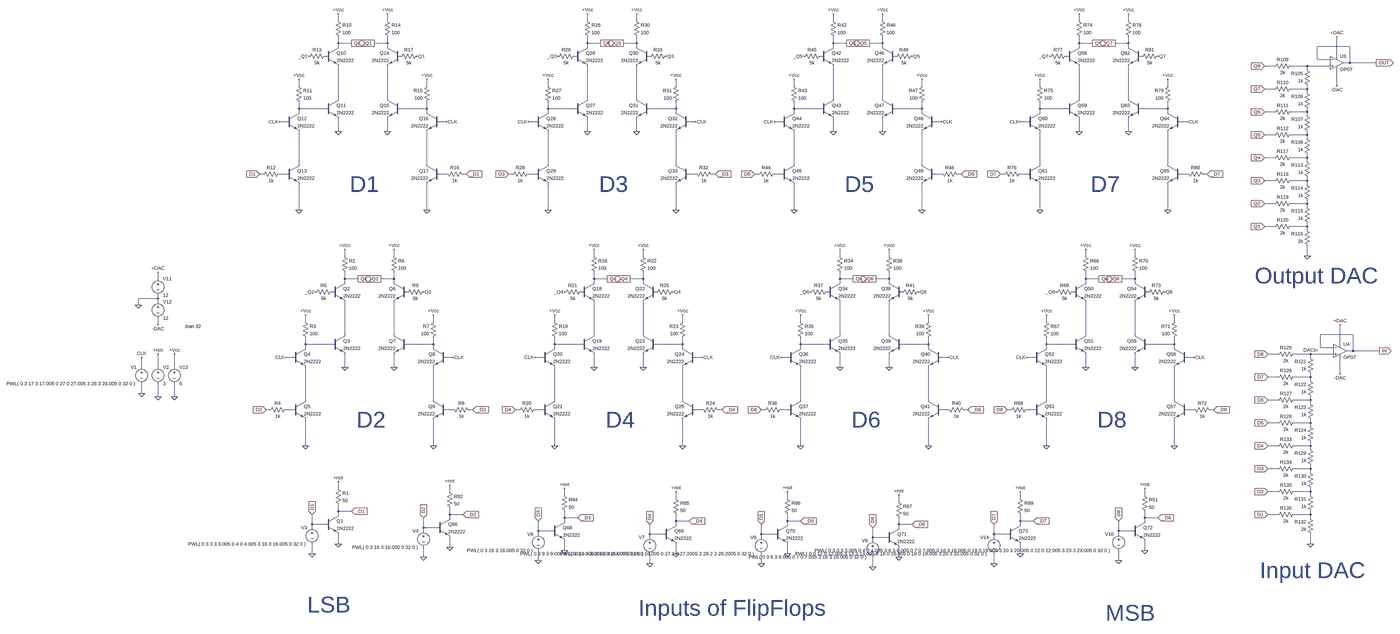
[diagram p0: schematic 1 Byte Memory.asc, whole sheet]
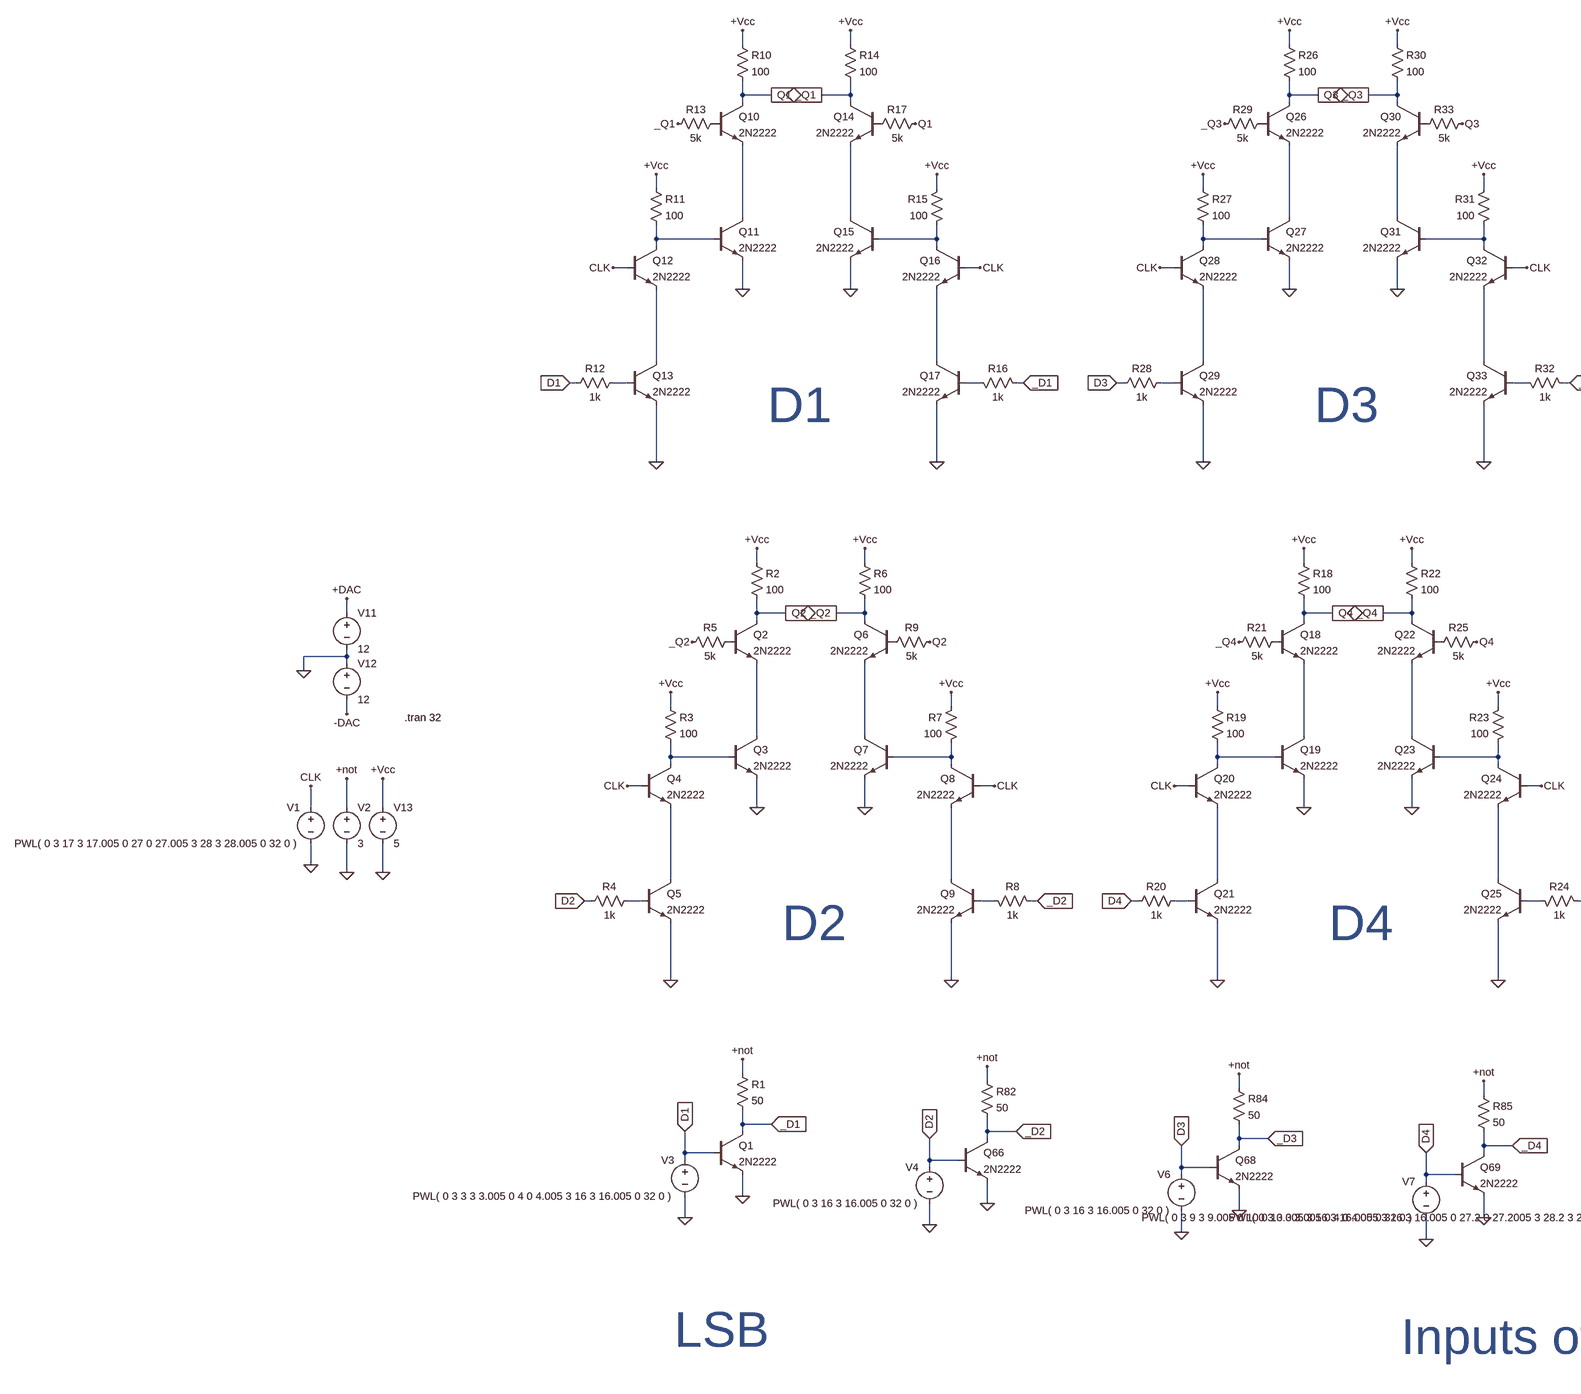
[diagram p1: schematic 1 Byte Memory.asc, part, row 1 of 1, column 1 of 2]
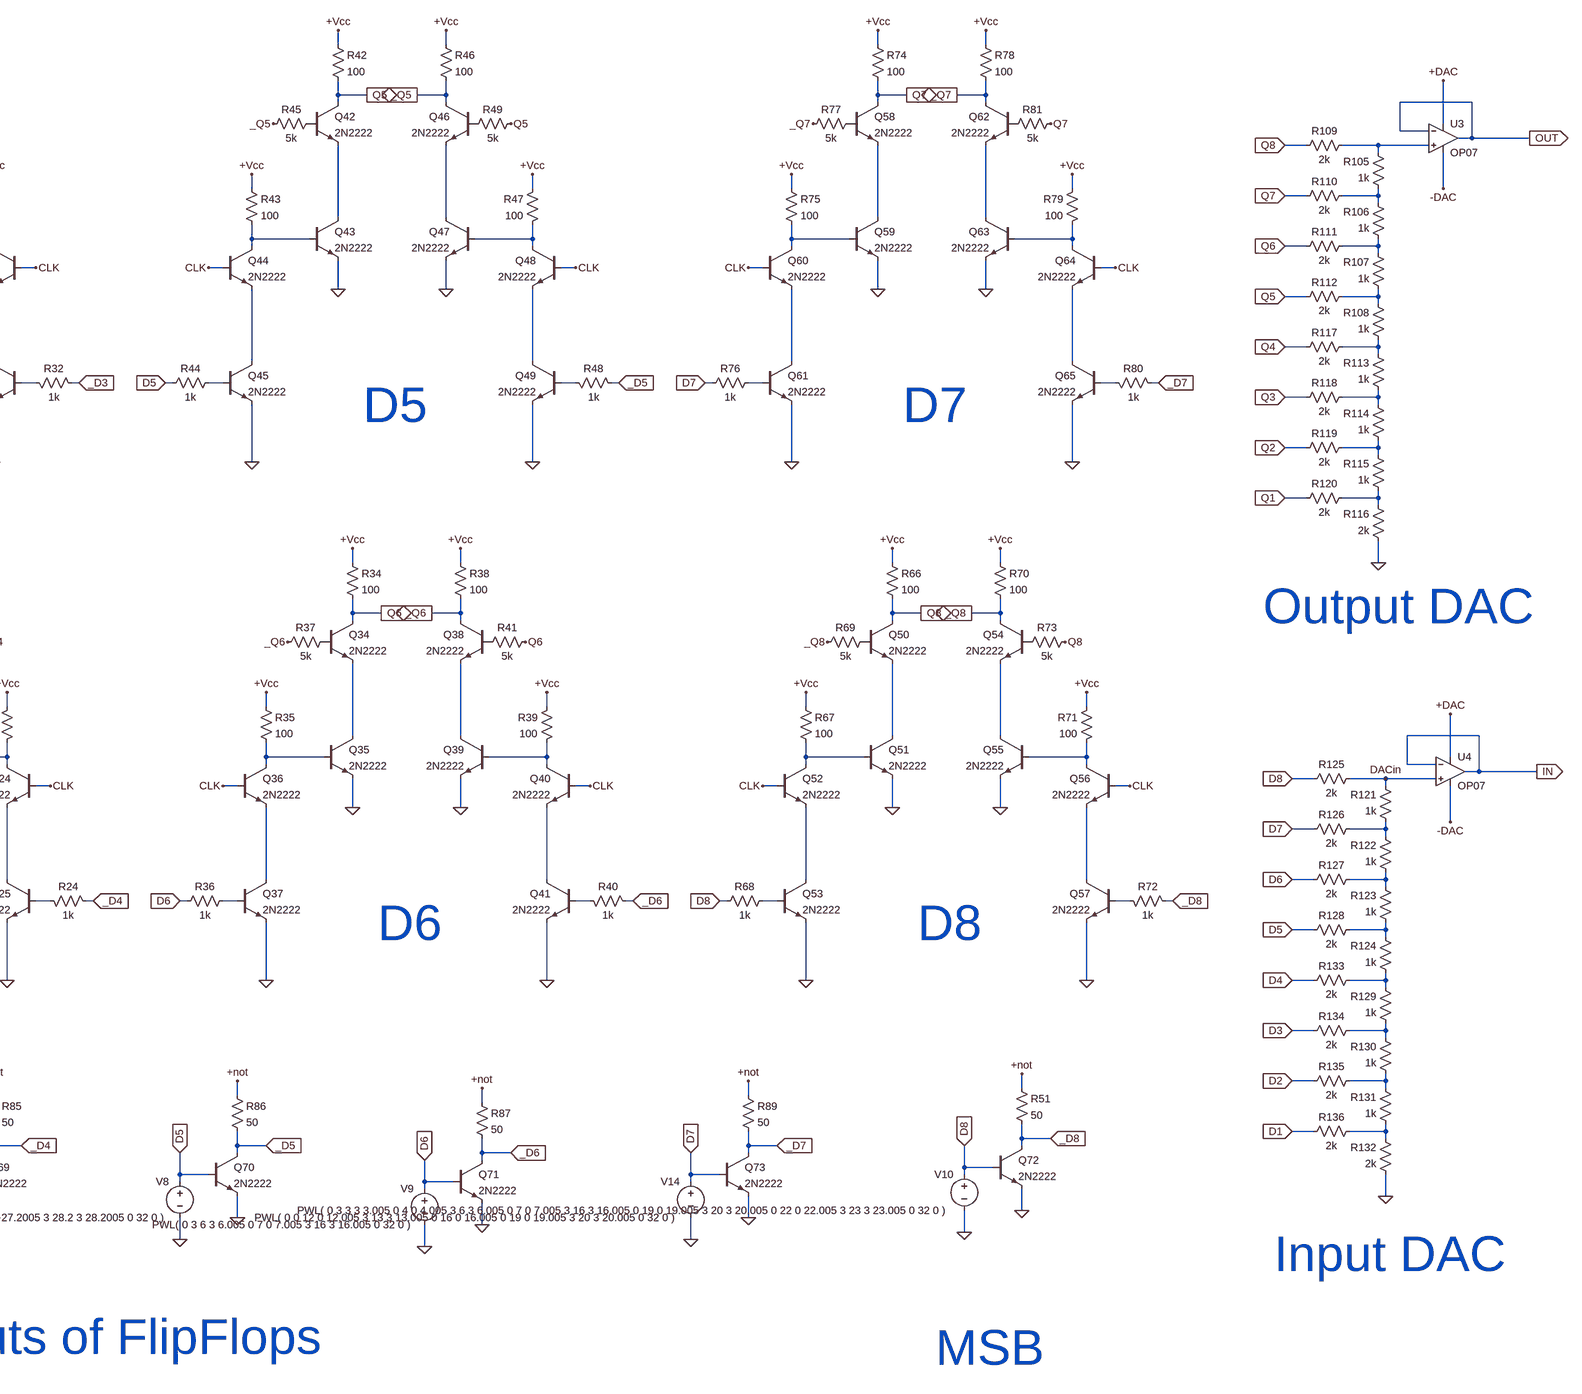
[diagram p2: schematic 1 Byte Memory.asc, part, row 1 of 1, column 2 of 2]
1 Byte Memory.asc, the LTspice schematic file:
Version 4
SHEET 1 6188 6752
WIRE 496 112 496 80
WIRE 736 112 736 80
WIRE 1712 112 1712 80
WIRE 1952 112 1952 80
WIRE 2912 112 2912 80
WIRE 3152 112 3152 80
WIRE 4112 112 4112 80
WIRE 4352 112 4352 80
WIRE 496 224 496 192
WIRE 560 224 496 224
WIRE 736 224 736 192
WIRE 736 224 672 224
WIRE 1712 224 1712 192
WIRE 1776 224 1712 224
WIRE 1952 224 1952 192
WIRE 1952 224 1888 224
WIRE 2912 224 2912 192
WIRE 2976 224 2912 224
WIRE 3152 224 3152 192
WIRE 3152 224 3088 224
WIRE 4112 224 4112 192
WIRE 4176 224 4112 224
WIRE 4352 224 4352 192
WIRE 4352 224 4288 224
WIRE 496 240 496 224
WIRE 736 240 736 224
WIRE 1712 240 1712 224
WIRE 1952 240 1952 224
WIRE 2912 240 2912 224
WIRE 3152 240 3152 224
WIRE 4112 240 4112 224
WIRE 4352 240 4352 224
WIRE 5536 240 5376 240
WIRE 5472 288 5472 192
WIRE 5376 304 5376 240
WIRE 5440 304 5376 304
WIRE 5536 320 5536 240
WIRE 5536 320 5504 320
WIRE 5664 320 5536 320
WIRE 5168 336 5120 336
WIRE 5328 336 5248 336
WIRE 5440 336 5328 336
WIRE 5328 352 5328 336
WIRE 304 432 304 400
WIRE 928 432 928 400
WIRE 1520 432 1520 400
WIRE 2144 432 2144 400
WIRE 2720 432 2720 400
WIRE 3344 432 3344 400
WIRE 3920 432 3920 400
WIRE 4544 432 4544 400
WIRE 5472 432 5472 352
WIRE 5168 448 5120 448
WIRE 5328 448 5328 432
WIRE 5328 448 5248 448
WIRE 5328 464 5328 448
WIRE 496 496 496 336
WIRE 736 496 736 336
WIRE 1712 496 1712 336
WIRE 1952 496 1952 336
WIRE 2912 496 2912 336
WIRE 3152 496 3152 336
WIRE 4112 496 4112 336
WIRE 4352 496 4352 336
WIRE 304 544 304 512
WIRE 432 544 304 544
WIRE 928 544 928 512
WIRE 928 544 800 544
WIRE 1520 544 1520 512
WIRE 1648 544 1520 544
WIRE 2144 544 2144 512
WIRE 2144 544 2016 544
WIRE 2720 544 2720 512
WIRE 2848 544 2720 544
WIRE 3344 544 3344 512
WIRE 3344 544 3216 544
WIRE 3920 544 3920 512
WIRE 4048 544 3920 544
WIRE 4544 544 4544 512
WIRE 4544 544 4416 544
WIRE 304 560 304 544
WIRE 928 560 928 544
WIRE 1520 560 1520 544
WIRE 2144 560 2144 544
WIRE 2720 560 2720 544
WIRE 3344 560 3344 544
WIRE 3920 560 3920 544
WIRE 4544 560 4544 544
WIRE 5168 560 5120 560
WIRE 5328 560 5328 544
WIRE 5328 560 5248 560
WIRE 5328 576 5328 560
WIRE 240 608 208 608
WIRE 1024 608 992 608
WIRE 1456 608 1424 608
WIRE 2240 608 2208 608
WIRE 2656 608 2624 608
WIRE 3440 608 3408 608
WIRE 3856 608 3824 608
WIRE 4640 608 4608 608
WIRE 496 656 496 592
WIRE 736 656 736 592
WIRE 1712 656 1712 592
WIRE 1952 656 1952 592
WIRE 2912 656 2912 592
WIRE 3152 656 3152 592
WIRE 4112 656 4112 592
WIRE 4352 656 4352 592
WIRE 5168 672 5120 672
WIRE 5328 672 5328 656
WIRE 5328 672 5248 672
WIRE 5328 688 5328 672
WIRE 5168 784 5120 784
WIRE 5328 784 5328 768
WIRE 5328 784 5248 784
WIRE 5328 800 5328 784
WIRE 304 816 304 656
WIRE 928 816 928 656
WIRE 1520 816 1520 656
WIRE 2144 816 2144 656
WIRE 2720 816 2720 656
WIRE 3344 816 3344 656
WIRE 3920 816 3920 656
WIRE 4544 816 4544 656
WIRE 128 864 112 864
WIRE 240 864 208 864
WIRE 1024 864 992 864
WIRE 1120 864 1104 864
WIRE 1344 864 1328 864
WIRE 1456 864 1424 864
WIRE 2240 864 2208 864
WIRE 2336 864 2320 864
WIRE 2544 864 2528 864
WIRE 2656 864 2624 864
WIRE 3440 864 3408 864
WIRE 3536 864 3520 864
WIRE 3744 864 3728 864
WIRE 3856 864 3824 864
WIRE 4640 864 4608 864
WIRE 4736 864 4720 864
WIRE 5168 896 5120 896
WIRE 5328 896 5328 880
WIRE 5328 896 5248 896
WIRE 5328 912 5328 896
WIRE 5168 1008 5120 1008
WIRE 5328 1008 5328 992
WIRE 5328 1008 5248 1008
WIRE 5328 1024 5328 1008
WIRE 304 1040 304 912
WIRE 928 1040 928 912
WIRE 1520 1040 1520 912
WIRE 2144 1040 2144 912
WIRE 2720 1040 2720 912
WIRE 3344 1040 3344 912
WIRE 3920 1040 3920 912
WIRE 4544 1040 4544 912
WIRE 5168 1120 5120 1120
WIRE 5328 1120 5328 1104
WIRE 5328 1120 5248 1120
WIRE 5328 1136 5328 1120
WIRE 528 1264 528 1232
WIRE 768 1264 768 1232
WIRE 1744 1264 1744 1232
WIRE 1984 1264 1984 1232
WIRE 2944 1264 2944 1232
WIRE 3184 1264 3184 1232
WIRE 4144 1264 4144 1232
WIRE 4384 1264 4384 1232
WIRE 5328 1264 5328 1216
WIRE -384 1376 -384 1344
WIRE 528 1376 528 1344
WIRE 592 1376 528 1376
WIRE 768 1376 768 1344
WIRE 768 1376 704 1376
WIRE 1744 1376 1744 1344
WIRE 1808 1376 1744 1376
WIRE 1984 1376 1984 1344
WIRE 1984 1376 1920 1376
WIRE 2944 1376 2944 1344
WIRE 3008 1376 2944 1376
WIRE 3184 1376 3184 1344
WIRE 3184 1376 3120 1376
WIRE 4144 1376 4144 1344
WIRE 4208 1376 4144 1376
WIRE 4384 1376 4384 1344
WIRE 4384 1376 4320 1376
WIRE 528 1392 528 1376
WIRE 768 1392 768 1376
WIRE 1744 1392 1744 1376
WIRE 1984 1392 1984 1376
WIRE 2944 1392 2944 1376
WIRE 3184 1392 3184 1376
WIRE 4144 1392 4144 1376
WIRE 4384 1392 4384 1376
WIRE -384 1472 -384 1456
WIRE -384 1472 -480 1472
WIRE -384 1488 -384 1472
WIRE -480 1504 -480 1472
WIRE 336 1584 336 1552
WIRE 960 1584 960 1552
WIRE 1552 1584 1552 1552
WIRE 2176 1584 2176 1552
WIRE 2752 1584 2752 1552
WIRE 3376 1584 3376 1552
WIRE 3952 1584 3952 1552
WIRE 4576 1584 4576 1552
WIRE -384 1600 -384 1568
WIRE 528 1648 528 1488
WIRE 768 1648 768 1488
WIRE 1744 1648 1744 1488
WIRE 1984 1648 1984 1488
WIRE 2944 1648 2944 1488
WIRE 3184 1648 3184 1488
WIRE 4144 1648 4144 1488
WIRE 4384 1648 4384 1488
WIRE 5552 1648 5392 1648
WIRE 336 1696 336 1664
WIRE 464 1696 336 1696
WIRE 960 1696 960 1664
WIRE 960 1696 832 1696
WIRE 1552 1696 1552 1664
WIRE 1680 1696 1552 1696
WIRE 2176 1696 2176 1664
WIRE 2176 1696 2048 1696
WIRE 2752 1696 2752 1664
WIRE 2880 1696 2752 1696
WIRE 3376 1696 3376 1664
WIRE 3376 1696 3248 1696
WIRE 3952 1696 3952 1664
WIRE 4080 1696 3952 1696
WIRE 4576 1696 4576 1664
WIRE 4576 1696 4448 1696
WIRE 5488 1696 5488 1600
WIRE 336 1712 336 1696
WIRE 960 1712 960 1696
WIRE 1552 1712 1552 1696
WIRE 2176 1712 2176 1696
WIRE 2752 1712 2752 1696
WIRE 3376 1712 3376 1696
WIRE 3952 1712 3952 1696
WIRE 4576 1712 4576 1696
WIRE 5392 1712 5392 1648
WIRE 5456 1712 5392 1712
WIRE 5552 1728 5552 1648
WIRE 5552 1728 5520 1728
WIRE 5680 1728 5552 1728
WIRE 5184 1744 5136 1744
WIRE 5344 1744 5264 1744
WIRE 5456 1744 5344 1744
WIRE 272 1760 240 1760
WIRE 1056 1760 1024 1760
WIRE 1488 1760 1456 1760
WIRE 2272 1760 2240 1760
WIRE 2688 1760 2656 1760
WIRE 3472 1760 3440 1760
WIRE 3888 1760 3856 1760
WIRE 4672 1760 4640 1760
WIRE 5344 1760 5344 1744
WIRE -464 1808 -464 1760
WIRE -384 1808 -384 1744
WIRE -304 1808 -304 1744
WIRE 528 1808 528 1744
WIRE 768 1808 768 1744
WIRE 1744 1808 1744 1744
WIRE 1984 1808 1984 1744
WIRE 2944 1808 2944 1744
WIRE 3184 1808 3184 1744
WIRE 4144 1808 4144 1744
WIRE 4384 1808 4384 1744
WIRE 5488 1840 5488 1760
WIRE 5184 1856 5136 1856
WIRE 5344 1856 5344 1840
WIRE 5344 1856 5264 1856
WIRE 5344 1872 5344 1856
WIRE -464 1936 -464 1888
WIRE -384 1952 -384 1888
WIRE -304 1952 -304 1888
WIRE 336 1968 336 1808
WIRE 960 1968 960 1808
WIRE 1552 1968 1552 1808
WIRE 2176 1968 2176 1808
WIRE 2752 1968 2752 1808
WIRE 3376 1968 3376 1808
WIRE 3952 1968 3952 1808
WIRE 4576 1968 4576 1808
WIRE 5184 1968 5136 1968
WIRE 5344 1968 5344 1952
WIRE 5344 1968 5264 1968
WIRE 5344 1984 5344 1968
WIRE 160 2016 144 2016
WIRE 272 2016 240 2016
WIRE 1056 2016 1024 2016
WIRE 1152 2016 1136 2016
WIRE 1376 2016 1360 2016
WIRE 1488 2016 1456 2016
WIRE 2272 2016 2240 2016
WIRE 2368 2016 2352 2016
WIRE 2576 2016 2560 2016
WIRE 2688 2016 2656 2016
WIRE 3472 2016 3440 2016
WIRE 3568 2016 3552 2016
WIRE 3776 2016 3760 2016
WIRE 3888 2016 3856 2016
WIRE 4672 2016 4640 2016
WIRE 4768 2016 4752 2016
WIRE 5184 2080 5136 2080
WIRE 5344 2080 5344 2064
WIRE 5344 2080 5264 2080
WIRE 5344 2096 5344 2080
WIRE 336 2192 336 2064
WIRE 960 2192 960 2064
WIRE 1552 2192 1552 2064
WIRE 2176 2192 2176 2064
WIRE 2752 2192 2752 2064
WIRE 3376 2192 3376 2064
WIRE 3952 2192 3952 2064
WIRE 4576 2192 4576 2064
WIRE 5184 2192 5136 2192
WIRE 5344 2192 5344 2176
WIRE 5344 2192 5264 2192
WIRE 5344 2208 5344 2192
WIRE 5184 2304 5136 2304
WIRE 5344 2304 5344 2288
WIRE 5344 2304 5264 2304
WIRE 5344 2320 5344 2304
WIRE 496 2400 496 2368
WIRE 1040 2416 1040 2384
WIRE 5184 2416 5136 2416
WIRE 5344 2416 5344 2400
WIRE 5344 2416 5264 2416
WIRE 1600 2432 1600 2400
WIRE 4432 2432 4432 2400
WIRE 5344 2432 5344 2416
WIRE 2144 2448 2144 2416
WIRE 2688 2448 2688 2416
WIRE 3824 2448 3824 2416
WIRE 3232 2464 3232 2432
WIRE 496 2512 496 2480
WIRE 560 2512 496 2512
WIRE 496 2528 496 2512
WIRE 1040 2528 1040 2496
WIRE 1104 2528 1040 2528
WIRE 5184 2528 5136 2528
WIRE 5344 2528 5344 2512
WIRE 5344 2528 5264 2528
WIRE 1040 2544 1040 2528
WIRE 1600 2544 1600 2512
WIRE 1664 2544 1600 2544
WIRE 4432 2544 4432 2512
WIRE 4496 2544 4432 2544
WIRE 5344 2544 5344 2528
WIRE 1600 2560 1600 2544
WIRE 2144 2560 2144 2528
WIRE 2208 2560 2144 2560
WIRE 2688 2560 2688 2528
WIRE 2752 2560 2688 2560
WIRE 3824 2560 3824 2528
WIRE 3888 2560 3824 2560
WIRE 4432 2560 4432 2544
WIRE 368 2576 368 2528
WIRE 432 2576 368 2576
WIRE 2144 2576 2144 2560
WIRE 2688 2576 2688 2560
WIRE 3232 2576 3232 2544
WIRE 3296 2576 3232 2576
WIRE 3824 2576 3824 2560
WIRE 368 2592 368 2576
WIRE 912 2592 912 2544
WIRE 976 2592 912 2592
WIRE 3232 2592 3232 2576
WIRE 912 2608 912 2592
WIRE 1472 2608 1472 2560
WIRE 1536 2608 1472 2608
WIRE 4304 2608 4304 2560
WIRE 4368 2608 4304 2608
WIRE 1472 2624 1472 2608
WIRE 2016 2624 2016 2576
WIRE 2080 2624 2016 2624
WIRE 2560 2624 2560 2576
WIRE 2624 2624 2560 2624
WIRE 3696 2624 3696 2576
WIRE 3760 2624 3696 2624
WIRE 4304 2624 4304 2608
WIRE 2016 2640 2016 2624
WIRE 2560 2640 2560 2624
WIRE 3104 2640 3104 2592
WIRE 3168 2640 3104 2640
WIRE 3696 2640 3696 2624
WIRE 3104 2656 3104 2640
WIRE 496 2672 496 2624
WIRE 5344 2672 5344 2624
WIRE 1040 2688 1040 2640
WIRE 1600 2704 1600 2656
WIRE 4432 2704 4432 2656
WIRE 368 2720 368 2672
WIRE 2144 2720 2144 2672
WIRE 2688 2720 2688 2672
WIRE 3824 2720 3824 2672
WIRE 912 2736 912 2688
WIRE 3232 2736 3232 2688
WIRE 1472 2752 1472 2704
WIRE 4304 2752 4304 2704
WIRE 2016 2768 2016 2720
WIRE 2560 2768 2560 2720
WIRE 3696 2768 3696 2720
WIRE 3104 2784 3104 2736
FLAG -384 1344 +DAC
FLAG -480 1504 0
FLAG -384 1600 -DAC
FLAG -464 1936 0
FLAG -464 1760 CLK
FLAG -384 1744 +not
FLAG -384 1952 0
FLAG -304 1952 0
FLAG -304 1744 +Vcc
FLAG 528 1232 +Vcc
FLAG 336 1552 +Vcc
FLAG 336 2192 0
FLAG 528 1808 0
FLAG 384 1440 _Q2
FLAG 592 1376 Q2
IOPIN 592 1376 Out
FLAG 240 1760 CLK
FLAG 144 2016 D2
IOPIN 144 2016 In
FLAG 768 1232 +Vcc
FLAG 960 1552 +Vcc
FLAG 960 2192 0
FLAG 768 1808 0
FLAG 912 1440 Q2
FLAG 704 1376 _Q2
IOPIN 704 1376 Out
FLAG 1056 1760 CLK
FLAG 1152 2016 _D2
IOPIN 1152 2016 In
FLAG 496 80 +Vcc
FLAG 304 400 +Vcc
FLAG 304 1040 0
FLAG 496 656 0
FLAG 352 288 _Q1
FLAG 560 224 Q1
IOPIN 560 224 Out
FLAG 208 608 CLK
FLAG 112 864 D1
IOPIN 112 864 In
FLAG 736 80 +Vcc
FLAG 928 400 +Vcc
FLAG 928 1040 0
FLAG 736 656 0
FLAG 880 288 Q1
FLAG 672 224 _Q1
IOPIN 672 224 Out
FLAG 1024 608 CLK
FLAG 1120 864 _D1
IOPIN 1120 864 In
FLAG 1744 1232 +Vcc
FLAG 1552 1552 +Vcc
FLAG 1552 2192 0
FLAG 1744 1808 0
FLAG 1600 1440 _Q4
FLAG 1808 1376 Q4
IOPIN 1808 1376 Out
FLAG 1456 1760 CLK
FLAG 1360 2016 D4
IOPIN 1360 2016 In
FLAG 1984 1232 +Vcc
FLAG 2176 1552 +Vcc
FLAG 2176 2192 0
FLAG 1984 1808 0
FLAG 2128 1440 Q4
FLAG 1920 1376 _Q4
IOPIN 1920 1376 Out
FLAG 2272 1760 CLK
FLAG 2368 2016 _D4
IOPIN 2368 2016 In
FLAG 1712 80 +Vcc
FLAG 1520 400 +Vcc
FLAG 1520 1040 0
FLAG 1712 656 0
FLAG 1568 288 _Q3
FLAG 1776 224 Q3
IOPIN 1776 224 Out
FLAG 1424 608 CLK
FLAG 1328 864 D3
IOPIN 1328 864 In
FLAG 1952 80 +Vcc
FLAG 2144 400 +Vcc
FLAG 2144 1040 0
FLAG 1952 656 0
FLAG 2096 288 Q3
FLAG 1888 224 _Q3
IOPIN 1888 224 Out
FLAG 2240 608 CLK
FLAG 2336 864 _D3
IOPIN 2336 864 In
FLAG 2944 1232 +Vcc
FLAG 2752 1552 +Vcc
FLAG 2752 2192 0
FLAG 2944 1808 0
FLAG 2800 1440 _Q6
FLAG 3008 1376 Q6
IOPIN 3008 1376 Out
FLAG 2656 1760 CLK
FLAG 2560 2016 D6
IOPIN 2560 2016 In
FLAG 3184 1232 +Vcc
FLAG 3376 1552 +Vcc
FLAG 3376 2192 0
FLAG 3184 1808 0
FLAG 3328 1440 Q6
FLAG 3120 1376 _Q6
IOPIN 3120 1376 Out
FLAG 3472 1760 CLK
FLAG 3568 2016 _D6
IOPIN 3568 2016 In
FLAG 2912 80 +Vcc
FLAG 2720 400 +Vcc
FLAG 2720 1040 0
FLAG 2912 656 0
FLAG 2768 288 _Q5
FLAG 2976 224 Q5
IOPIN 2976 224 Out
FLAG 2624 608 CLK
FLAG 2528 864 D5
IOPIN 2528 864 In
FLAG 3152 80 +Vcc
FLAG 3344 400 +Vcc
FLAG 3344 1040 0
FLAG 3152 656 0
FLAG 3296 288 Q5
FLAG 3088 224 _Q5
IOPIN 3088 224 Out
FLAG 3440 608 CLK
FLAG 3536 864 _D5
IOPIN 3536 864 In
FLAG 4144 1232 +Vcc
FLAG 3952 1552 +Vcc
FLAG 3952 2192 0
FLAG 4144 1808 0
FLAG 4000 1440 _Q8
FLAG 4208 1376 Q8
IOPIN 4208 1376 Out
FLAG 3856 1760 CLK
FLAG 3760 2016 D8
IOPIN 3760 2016 In
FLAG 4384 1232 +Vcc
FLAG 4576 1552 +Vcc
FLAG 4576 2192 0
FLAG 4384 1808 0
FLAG 4528 1440 Q8
FLAG 4320 1376 _Q8
IOPIN 4320 1376 Out
FLAG 4672 1760 CLK
FLAG 4768 2016 _D8
IOPIN 4768 2016 In
FLAG 4112 80 +Vcc
FLAG 3920 400 +Vcc
FLAG 3920 1040 0
FLAG 4112 656 0
FLAG 3968 288 _Q7
FLAG 4176 224 Q7
IOPIN 4176 224 Out
FLAG 3824 608 CLK
FLAG 3728 864 D7
IOPIN 3728 864 In
FLAG 4352 80 +Vcc
FLAG 4544 400 +Vcc
FLAG 4544 1040 0
FLAG 4352 656 0
FLAG 4496 288 Q7
FLAG 4288 224 _Q7
IOPIN 4288 224 Out
FLAG 4640 608 CLK
FLAG 4736 864 _D7
IOPIN 4736 864 In
FLAG 496 2368 +not
FLAG 496 2672 0
FLAG 560 2512 _D1
IOPIN 560 2512 In
FLAG 368 2720 0
FLAG 368 2528 D1
IOPIN 368 2528 In
FLAG 1040 2384 +not
FLAG 1040 2688 0
FLAG 1104 2528 _D2
IOPIN 1104 2528 In
FLAG 912 2736 0
FLAG 912 2544 D2
IOPIN 912 2544 In
FLAG 1600 2400 +not
FLAG 1600 2704 0
FLAG 1664 2544 _D3
IOPIN 1664 2544 In
FLAG 1472 2752 0
FLAG 1472 2560 D3
IOPIN 1472 2560 In
FLAG 2144 2416 +not
FLAG 2144 2720 0
FLAG 2208 2560 _D4
IOPIN 2208 2560 In
FLAG 2016 2768 0
FLAG 2016 2576 D4
IOPIN 2016 2576 In
FLAG 2688 2416 +not
FLAG 2688 2720 0
FLAG 2752 2560 _D5
IOPIN 2752 2560 In
FLAG 2560 2768 0
FLAG 2560 2576 D5
IOPIN 2560 2576 In
FLAG 3232 2432 +not
FLAG 3232 2736 0
FLAG 3296 2576 _D6
IOPIN 3296 2576 In
FLAG 3104 2784 0
FLAG 3104 2592 D6
IOPIN 3104 2592 In
FLAG 3824 2416 +not
FLAG 3824 2720 0
FLAG 3888 2560 _D7
IOPIN 3888 2560 In
FLAG 3696 2768 0
FLAG 3696 2576 D7
IOPIN 3696 2576 In
FLAG 5664 320 OUT
IOPIN 5664 320 Out
FLAG 5120 336 Q8
IOPIN 5120 336 In
FLAG 5120 448 Q7
IOPIN 5120 448 In
FLAG 5120 560 Q6
IOPIN 5120 560 In
FLAG 5120 672 Q5
IOPIN 5120 672 In
FLAG 5472 192 +DAC
FLAG 5472 432 -DAC
FLAG 5120 784 Q4
IOPIN 5120 784 In
FLAG 5120 896 Q3
IOPIN 5120 896 In
FLAG 5120 1008 Q2
IOPIN 5120 1008 In
FLAG 5120 1120 Q1
IOPIN 5120 1120 In
FLAG 5328 1264 0
FLAG 5680 1728 IN
IOPIN 5680 1728 Out
FLAG 5136 1744 D8
IOPIN 5136 1744 In
FLAG 5136 1856 D7
IOPIN 5136 1856 In
FLAG 5136 1968 D6
IOPIN 5136 1968 In
FLAG 5136 2080 D5
IOPIN 5136 2080 In
FLAG 5488 1600 +DAC
FLAG 5488 1840 -DAC
FLAG 5136 2192 D4
IOPIN 5136 2192 In
FLAG 5136 2304 D3
IOPIN 5136 2304 In
FLAG 5136 2416 D2
IOPIN 5136 2416 In
FLAG 5136 2528 D1
IOPIN 5136 2528 In
FLAG 5344 2672 0
FLAG 5344 1744 DACin
FLAG 4432 2400 +not
FLAG 4432 2704 0
FLAG 4496 2544 _D8
IOPIN 4496 2544 In
FLAG 4304 2752 0
FLAG 4304 2560 D8
IOPIN 4304 2560 In
SYMBOL voltage -384 1360 R0
SYMATTR InstName V11
SYMATTR Value 12
SYMBOL voltage -384 1472 R0
SYMATTR InstName V12
SYMATTR Value 12
SYMBOL voltage -464 1792 M0
SYMATTR InstName V1
SYMATTR Value PWL( 0 3 17 3 17.005 0 27 0 27.005 3 28 3 28.005 0 32 0 )
SYMBOL voltage -384 1792 R0
SYMATTR InstName V2
SYMATTR Value 3
SYMBOL voltage -304 1792 R0
SYMATTR InstName V13
SYMATTR Value 5
SYMBOL npn 464 1392 R0
SYMATTR InstName Q2
SYMATTR Value 2N2222
SYMBOL npn 464 1648 R0
SYMATTR InstName Q3
SYMATTR Value 2N2222
SYMBOL Res 512 1248 R0
SYMATTR InstName R2
SYMATTR Value 100
SYMBOL npn 272 1712 R0
SYMATTR InstName Q4
SYMATTR Value 2N2222
SYMBOL npn 272 1968 R0
SYMATTR InstName Q5
SYMATTR Value 2N2222
SYMBOL Res 320 1568 R0
SYMATTR InstName R3
SYMATTR Value 100
SYMBOL Res 256 2000 R90
WINDOW 0 0 56 VBottom 2
WINDOW 3 32 56 VTop 2
SYMATTR InstName R4
SYMATTR Value 1k
SYMBOL Res 480 1424 R90
WINDOW 0 0 56 VBottom 2
WINDOW 3 32 56 VTop 2
SYMATTR InstName R5
SYMATTR Value 5k
SYMBOL npn 832 1392 M0
SYMATTR InstName Q6
SYMATTR Value 2N2222
SYMBOL npn 832 1648 M0
SYMATTR InstName Q7
SYMATTR Value 2N2222
SYMBOL Res 752 1248 R0
SYMATTR InstName R6
SYMATTR Value 100
SYMBOL npn 1024 1712 M0
SYMATTR InstName Q8
SYMATTR Value 2N2222
SYMBOL npn 1024 1968 M0
SYMATTR InstName Q9
SYMATTR Value 2N2222
SYMBOL Res 976 1568 M0
SYMATTR InstName R7
SYMATTR Value 100
SYMBOL Res 1152 2032 M270
WINDOW 0 32 56 VTop 2
WINDOW 3 0 56 VBottom 2
SYMATTR InstName R8
SYMATTR Value 1k
SYMBOL Res 928 1424 R90
WINDOW 0 0 56 VBottom 2
WINDOW 3 32 56 VTop 2
SYMATTR InstName R9
SYMATTR Value 5k
SYMBOL npn 432 240 R0
SYMATTR InstName Q10
SYMATTR Value 2N2222
SYMBOL npn 432 496 R0
SYMATTR InstName Q11
SYMATTR Value 2N2222
SYMBOL Res 480 96 R0
SYMATTR InstName R10
SYMATTR Value 100
SYMBOL npn 240 560 R0
SYMATTR InstName Q12
SYMATTR Value 2N2222
SYMBOL npn 240 816 R0
SYMATTR InstName Q13
SYMATTR Value 2N2222
SYMBOL Res 288 416 R0
SYMATTR InstName R11
SYMATTR Value 100
SYMBOL Res 224 848 R90
WINDOW 0 0 56 VBottom 2
WINDOW 3 32 56 VTop 2
SYMATTR InstName R12
SYMATTR Value 1k
SYMBOL Res 448 272 R90
WINDOW 0 0 56 VBottom 2
WINDOW 3 32 56 VTop 2
SYMATTR InstName R13
SYMATTR Value 5k
SYMBOL npn 800 240 M0
SYMATTR InstName Q14
SYMATTR Value 2N2222
SYMBOL npn 800 496 M0
SYMATTR InstName Q15
SYMATTR Value 2N2222
SYMBOL Res 720 96 R0
SYMATTR InstName R14
SYMATTR Value 100
SYMBOL npn 992 560 M0
SYMATTR InstName Q16
SYMATTR Value 2N2222
SYMBOL npn 992 816 M0
SYMATTR InstName Q17
SYMATTR Value 2N2222
SYMBOL Res 944 416 M0
SYMATTR InstName R15
SYMATTR Value 100
SYMBOL Res 1120 880 M270
WINDOW 0 32 56 VTop 2
WINDOW 3 0 56 VBottom 2
SYMATTR InstName R16
SYMATTR Value 1k
SYMBOL Res 896 272 R90
WINDOW 0 0 56 VBottom 2
WINDOW 3 32 56 VTop 2
SYMATTR InstName R17
SYMATTR Value 5k
SYMBOL npn 1680 1392 R0
SYMATTR InstName Q18
SYMATTR Value 2N2222
SYMBOL npn 1680 1648 R0
SYMATTR InstName Q19
SYMATTR Value 2N2222
SYMBOL Res 1728 1248 R0
SYMATTR InstName R18
SYMATTR Value 100
SYMBOL npn 1488 1712 R0
SYMATTR InstName Q20
SYMATTR Value 2N2222
SYMBOL npn 1488 1968 R0
SYMATTR InstName Q21
SYMATTR Value 2N2222
SYMBOL Res 1536 1568 R0
SYMATTR InstName R19
SYMATTR Value 100
SYMBOL Res 1472 2000 R90
WINDOW 0 0 56 VBottom 2
WINDOW 3 32 56 VTop 2
SYMATTR InstName R20
SYMATTR Value 1k
SYMBOL Res 1696 1424 R90
WINDOW 0 0 56 VBottom 2
WINDOW 3 32 56 VTop 2
SYMATTR InstName R21
SYMATTR Value 5k
SYMBOL npn 2048 1392 M0
SYMATTR InstName Q22
SYMATTR Value 2N2222
SYMBOL npn 2048 1648 M0
SYMATTR InstName Q23
SYMATTR Value 2N2222
SYMBOL Res 1968 1248 R0
SYMATTR InstName R22
SYMATTR Value 100
SYMBOL npn 2240 1712 M0
SYMATTR InstName Q24
SYMATTR Value 2N2222
SYMBOL npn 2240 1968 M0
SYMATTR InstName Q25
SYMATTR Value 2N2222
SYMBOL Res 2192 1568 M0
SYMATTR InstName R23
SYMATTR Value 100
SYMBOL Res 2368 2032 M270
WINDOW 0 32 56 VTop 2
WINDOW 3 0 56 VBottom 2
SYMATTR InstName R24
SYMATTR Value 1k
SYMBOL Res 2144 1424 R90
WINDOW 0 0 56 VBottom 2
WINDOW 3 32 56 VTop 2
SYMATTR InstName R25
SYMATTR Value 5k
SYMBOL npn 1648 240 R0
SYMATTR InstName Q26
SYMATTR Value 2N2222
SYMBOL npn 1648 496 R0
SYMATTR InstName Q27
SYMATTR Value 2N2222
SYMBOL Res 1696 96 R0
SYMATTR InstName R26
SYMATTR Value 100
SYMBOL npn 1456 560 R0
SYMATTR InstName Q28
SYMATTR Value 2N2222
SYMBOL npn 1456 816 R0
SYMATTR InstName Q29
SYMATTR Value 2N2222
SYMBOL Res 1504 416 R0
SYMATTR InstName R27
SYMATTR Value 100
SYMBOL Res 1440 848 R90
WINDOW 0 0 56 VBottom 2
WINDOW 3 32 56 VTop 2
SYMATTR InstName R28
SYMATTR Value 1k
SYMBOL Res 1664 272 R90
WINDOW 0 0 56 VBottom 2
WINDOW 3 32 56 VTop 2
SYMATTR InstName R29
SYMATTR Value 5k
SYMBOL npn 2016 240 M0
SYMATTR InstName Q30
SYMATTR Value 2N2222
SYMBOL npn 2016 496 M0
SYMATTR InstName Q31
SYMATTR Value 2N2222
SYMBOL Res 1936 96 R0
SYMATTR InstName R30
SYMATTR Value 100
SYMBOL npn 2208 560 M0
SYMATTR InstName Q32
SYMATTR Value 2N2222
SYMBOL npn 2208 816 M0
SYMATTR InstName Q33
SYMATTR Value 2N2222
SYMBOL Res 2160 416 M0
SYMATTR InstName R31
SYMATTR Value 100
SYMBOL Res 2336 880 M270
WINDOW 0 32 56 VTop 2
WINDOW 3 0 56 VBottom 2
SYMATTR InstName R32
SYMATTR Value 1k
SYMBOL Res 2112 272 R90
WINDOW 0 0 56 VBottom 2
WINDOW 3 32 56 VTop 2
SYMATTR InstName R33
SYMATTR Value 5k
SYMBOL npn 2880 1392 R0
SYMATTR InstName Q34
SYMATTR Value 2N2222
SYMBOL npn 2880 1648 R0
SYMATTR InstName Q35
SYMATTR Value 2N2222
SYMBOL Res 2928 1248 R0
SYMATTR InstName R34
SYMATTR Value 100
SYMBOL npn 2688 1712 R0
SYMATTR InstName Q36
SYMATTR Value 2N2222
SYMBOL npn 2688 1968 R0
SYMATTR InstName Q37
SYMATTR Value 2N2222
SYMBOL Res 2736 1568 R0
SYMATTR InstName R35
SYMATTR Value 100
SYMBOL Res 2672 2000 R90
WINDOW 0 0 56 VBottom 2
WINDOW 3 32 56 VTop 2
SYMATTR InstName R36
SYMATTR Value 1k
SYMBOL Res 2896 1424 R90
WINDOW 0 0 56 VBottom 2
WINDOW 3 32 56 VTop 2
SYMATTR InstName R37
SYMATTR Value 5k
SYMBOL npn 3248 1392 M0
SYMATTR InstName Q38
SYMATTR Value 2N2222
SYMBOL npn 3248 1648 M0
SYMATTR InstName Q39
SYMATTR Value 2N2222
SYMBOL Res 3168 1248 R0
SYMATTR InstName R38
SYMATTR Value 100
SYMBOL npn 3440 1712 M0
SYMATTR InstName Q40
SYMATTR Value 2N2222
SYMBOL npn 3440 1968 M0
SYMATTR InstName Q41
SYMATTR Value 2N2222
SYMBOL Res 3392 1568 M0
SYMATTR InstName R39
SYMATTR Value 100
SYMBOL Res 3568 2032 M270
WINDOW 0 32 56 VTop 2
WINDOW 3 0 56 VBottom 2
SYMATTR InstName R40
SYMATTR Value 1k
SYMBOL Res 3344 1424 R90
WINDOW 0 0 56 VBottom 2
WINDOW 3 32 56 VTop 2
SYMATTR InstName R41
SYMATTR Value 5k
SYMBOL npn 2848 240 R0
SYMATTR InstName Q42
SYMATTR Value 2N2222
SYMBOL npn 2848 496 R0
SYMATTR InstName Q43
SYMATTR Value 2N2222
SYMBOL Res 2896 96 R0
SYMATTR InstName R42
SYMATTR Value 100
SYMBOL npn 2656 560 R0
SYMATTR InstName Q44
SYMATTR Value 2N2222
SYMBOL npn 2656 816 R0
SYMATTR InstName Q45
SYMATTR Value 2N2222
SYMBOL Res 2704 416 R0
SYMATTR InstName R43
SYMATTR Value 100
SYMBOL Res 2640 848 R90
WINDOW 0 0 56 VBottom 2
WINDOW 3 32 56 VTop 2
SYMATTR InstName R44
SYMATTR Value 1k
SYMBOL Res 2864 272 R90
WINDOW 0 0 56 VBottom 2
WINDOW 3 32 56 VTop 2
SYMATTR InstName R45
SYMATTR Value 5k
SYMBOL npn 3216 240 M0
SYMATTR InstName Q46
SYMATTR Value 2N2222
SYMBOL npn 3216 496 M0
SYMATTR InstName Q47
SYMATTR Value 2N2222
SYMBOL Res 3136 96 R0
SYMATTR InstName R46
SYMATTR Value 100
SYMBOL npn 3408 560 M0
SYMATTR InstName Q48
SYMATTR Value 2N2222
SYMBOL npn 3408 816 M0
SYMATTR InstName Q49
SYMATTR Value 2N2222
SYMBOL Res 3360 416 M0
SYMATTR InstName R47
SYMATTR Value 100
SYMBOL Res 3536 880 M270
WINDOW 0 32 56 VTop 2
WINDOW 3 0 56 VBottom 2
SYMATTR InstName R48
SYMATTR Value 1k
SYMBOL Res 3312 272 R90
WINDOW 0 0 56 VBottom 2
WINDOW 3 32 56 VTop 2
SYMATTR InstName R49
SYMATTR Value 5k
SYMBOL npn 4080 1392 R0
SYMATTR InstName Q50
SYMATTR Value 2N2222
SYMBOL npn 4080 1648 R0
SYMATTR InstName Q51
SYMATTR Value 2N2222
SYMBOL Res 4128 1248 R0
SYMATTR InstName R66
SYMATTR Value 100
SYMBOL npn 3888 1712 R0
SYMATTR InstName Q52
SYMATTR Value 2N2222
SYMBOL npn 3888 1968 R0
SYMATTR InstName Q53
SYMATTR Value 2N2222
SYMBOL Res 3936 1568 R0
SYMATTR InstName R67
SYMATTR Value 100
SYMBOL Res 3872 2000 R90
WINDOW 0 0 56 VBottom 2
WINDOW 3 32 56 VTop 2
SYMATTR InstName R68
SYMATTR Value 1k
SYMBOL Res 4096 1424 R90
WINDOW 0 0 56 VBottom 2
WINDOW 3 32 56 VTop 2
SYMATTR InstName R69
SYMATTR Value 5k
SYMBOL npn 4448 1392 M0
SYMATTR InstName Q54
SYMATTR Value 2N2222
SYMBOL npn 4448 1648 M0
SYMATTR InstName Q55
SYMATTR Value 2N2222
SYMBOL Res 4368 1248 R0
SYMATTR InstName R70
SYMATTR Value 100
SYMBOL npn 4640 1712 M0
SYMATTR InstName Q56
SYMATTR Value 2N2222
SYMBOL npn 4640 1968 M0
SYMATTR InstName Q57
SYMATTR Value 2N2222
SYMBOL Res 4592 1568 M0
SYMATTR InstName R71
SYMATTR Value 100
SYMBOL Res 4768 2032 M270
WINDOW 0 32 56 VTop 2
WINDOW 3 0 56 VBottom 2
SYMATTR InstName R72
SYMATTR Value 1k
SYMBOL Res 4544 1424 R90
WINDOW 0 0 56 VBottom 2
WINDOW 3 32 56 VTop 2
SYMATTR InstName R73
SYMATTR Value 5k
SYMBOL npn 4048 240 R0
SYMATTR InstName Q58
SYMATTR Value 2N2222
SYMBOL npn 4048 496 R0
SYMATTR InstName Q59
SYMATTR Value 2N2222
SYMBOL Res 4096 96 R0
SYMATTR InstName R74
SYMATTR Value 100
SYMBOL npn 3856 560 R0
SYMATTR InstName Q60
SYMATTR Value 2N2222
SYMBOL npn 3856 816 R0
SYMATTR InstName Q61
SYMATTR Value 2N2222
SYMBOL Res 3904 416 R0
SYMATTR InstName R75
SYMATTR Value 100
SYMBOL Res 3840 848 R90
WINDOW 0 0 56 VBottom 2
WINDOW 3 32 56 VTop 2
SYMATTR InstName R76
SYMATTR Value 1k
SYMBOL Res 4064 272 R90
WINDOW 0 0 56 VBottom 2
WINDOW 3 32 56 VTop 2
SYMATTR InstName R77
SYMATTR Value 5k
SYMBOL npn 4416 240 M0
SYMATTR InstName Q62
SYMATTR Value 2N2222
SYMBOL npn 4416 496 M0
SYMATTR InstName Q63
SYMATTR Value 2N2222
SYMBOL Res 4336 96 R0
SYMATTR InstName R78
SYMATTR Value 100
SYMBOL npn 4608 560 M0
SYMATTR InstName Q64
SYMATTR Value 2N2222
SYMBOL npn 4608 816 M0
SYMATTR InstName Q65
SYMATTR Value 2N2222
SYMBOL Res 4560 416 M0
SYMATTR InstName R79
SYMATTR Value 100
SYMBOL Res 4736 880 M270
WINDOW 0 32 56 VTop 2
WINDOW 3 0 56 VBottom 2
SYMATTR InstName R80
SYMATTR Value 1k
SYMBOL Res 4512 272 R90
WINDOW 0 0 56 VBottom 2
WINDOW 3 32 56 VTop 2
SYMATTR InstName R81
SYMATTR Value 5k
SYMBOL npn 432 2528 R0
SYMATTR InstName Q1
SYMATTR Value 2N2222
SYMBOL Res 480 2384 R0
SYMATTR InstName R1
SYMATTR Value 50
SYMBOL voltage 368 2576 M0
SYMATTR InstName V3
SYMATTR Value PWL( 0 3 3 3 3.005 0 4 0 4.005 3 16 3 16.005 0 32 0 )
SYMBOL npn 976 2544 R0
SYMATTR InstName Q66
SYMATTR Value 2N2222
SYMBOL Res 1024 2400 R0
SYMATTR InstName R82
SYMATTR Value 50
SYMBOL voltage 912 2592 M0
SYMATTR InstName V4
SYMATTR Value PWL( 0 3 16 3 16.005 0 32 0 )
SYMBOL npn 1536 2560 R0
SYMATTR InstName Q68
SYMATTR Value 2N2222
SYMBOL Res 1584 2416 R0
SYMATTR InstName R84
SYMATTR Value 50
SYMBOL voltage 1472 2608 M0
SYMATTR InstName V6
SYMATTR Value PWL( 0 3 16 3 16.005 0 32 0 )
SYMBOL npn 2080 2576 R0
SYMATTR InstName Q69
SYMATTR Value 2N2222
SYMBOL Res 2128 2432 R0
SYMATTR InstName R85
SYMATTR Value 50
SYMBOL voltage 2016 2624 M0
SYMATTR InstName V7
SYMATTR Value PWL( 0 3 9 3 9.005 0 10 0 10.005 3 16 3 16.005 0 32 0 )
SYMBOL npn 2624 2576 R0
SYMATTR InstName Q70
SYMATTR Value 2N2222
SYMBOL Res 2672 2432 R0
SYMATTR InstName R86
SYMATTR Value 50
SYMBOL voltage 2560 2624 M0
SYMATTR InstName V8
SYMATTR Value PWL( 0 3 3 3 3.005 0 4 0 4.005 3 16 3 16.005 0 27.2 0 27.2005 3 28.2 3 28.2005 0 32 0 )
SYMBOL npn 3168 2592 R0
SYMATTR InstName Q71
SYMATTR Value 2N2222
SYMBOL Res 3216 2448 R0
SYMATTR InstName R87
SYMATTR Value 50
SYMBOL voltage 3104 2640 M0
SYMATTR InstName V9
SYMATTR Value PWL( 0 3 6 3 6.005 0 7 0 7.005 3 16 3 16.005 0 32 0 )
SYMBOL npn 3760 2576 R0
SYMATTR InstName Q73
SYMATTR Value 2N2222
SYMBOL Res 3808 2432 R0
SYMATTR InstName R89
SYMATTR Value 50
SYMBOL voltage 3696 2624 M0
SYMATTR InstName V14
SYMATTR Value PWL( 0 0 12 0 12.005 3 13 3 13.005 0 16 0 16.005 0 19 0 19.005 3 20 3 20.005 0 32 0 )
SYMBOL OpAmps/OP07 5472 256 R0
SYMATTR InstName U3
SYMBOL Res 5344 448 R180
WINDOW 0 36 76 Left 2
WINDOW 3 36 40 Left 2
SYMATTR InstName R105
SYMATTR Value 1k
SYMBOL Res 5344 560 R180
WINDOW 0 36 76 Left 2
WINDOW 3 36 40 Left 2
SYMATTR InstName R106
SYMATTR Value 1k
SYMBOL Res 5344 672 R180
WINDOW 0 36 76 Left 2
WINDOW 3 36 40 Left 2
SYMATTR InstName R107
SYMATTR Value 1k
SYMBOL Res 5344 784 R180
WINDOW 0 36 76 Left 2
WINDOW 3 36 40 Left 2
SYMATTR InstName R108
SYMATTR Value 1k
SYMBOL Res 5264 320 R90
WINDOW 0 0 56 VBottom 2
WINDOW 3 32 56 VTop 2
SYMATTR InstName R109
SYMATTR Value 2k
SYMBOL Res 5264 432 R90
WINDOW 0 0 56 VBottom 2
WINDOW 3 32 56 VTop 2
SYMATTR InstName R110
SYMATTR Value 2k
SYMBOL Res 5264 544 R90
WINDOW 0 0 56 VBottom 2
WINDOW 3 32 56 VTop 2
SYMATTR InstName R111
SYMATTR Value 2k
SYMBOL Res 5264 656 R90
WINDOW 0 0 56 VBottom 2
WINDOW 3 32 56 VTop 2
SYMATTR InstName R112
SYMATTR Value 2k
SYMBOL Res 5344 896 R180
WINDOW 0 36 76 Left 2
WINDOW 3 36 40 Left 2
SYMATTR InstName R113
SYMATTR Value 1k
SYMBOL Res 5344 1008 R180
WINDOW 0 36 76 Left 2
WINDOW 3 36 40 Left 2
SYMATTR InstName R114
SYMATTR Value 1k
SYMBOL Res 5344 1120 R180
WINDOW 0 36 76 Left 2
WINDOW 3 36 40 Left 2
SYMATTR InstName R115
SYMATTR Value 1k
SYMBOL Res 5344 1232 R180
WINDOW 0 36 76 Left 2
WINDOW 3 36 40 Left 2
SYMATTR InstName R116
SYMATTR Value 2k
SYMBOL Res 5264 768 R90
WINDOW 0 0 56 VBottom 2
WINDOW 3 32 56 VTop 2
SYMATTR InstName R117
SYMATTR Value 2k
SYMBOL Res 5264 880 R90
WINDOW 0 0 56 VBottom 2
WINDOW 3 32 56 VTop 2
SYMATTR InstName R118
SYMATTR Value 2k
SYMBOL Res 5264 992 R90
WINDOW 0 0 56 VBottom 2
WINDOW 3 32 56 VTop 2
SYMATTR InstName R119
SYMATTR Value 2k
SYMBOL Res 5264 1104 R90
WINDOW 0 0 56 VBottom 2
WINDOW 3 32 56 VTop 2
SYMATTR InstName R120
SYMATTR Value 2k
SYMBOL OpAmps/OP07 5488 1664 R0
SYMATTR InstName U4
SYMBOL Res 5360 1856 R180
WINDOW 0 36 76 Left 2
WINDOW 3 36 40 Left 2
SYMATTR InstName R121
SYMATTR Value 1k
SYMBOL Res 5360 1968 R180
WINDOW 0 36 76 Left 2
WINDOW 3 36 40 Left 2
SYMATTR InstName R122
SYMATTR Value 1k
SYMBOL Res 5360 2080 R180
WINDOW 0 36 76 Left 2
WINDOW 3 36 40 Left 2
SYMATTR InstName R123
SYMATTR Value 1k
SYMBOL Res 5360 2192 R180
WINDOW 0 36 76 Left 2
WINDOW 3 36 40 Left 2
SYMATTR InstName R124
SYMATTR Value 1k
SYMBOL Res 5280 1728 R90
WINDOW 0 0 56 VBottom 2
WINDOW 3 32 56 VTop 2
SYMATTR InstName R125
SYMATTR Value 2k
SYMBOL Res 5280 1840 R90
WINDOW 0 0 56 VBottom 2
WINDOW 3 32 56 VTop 2
SYMATTR InstName R126
SYMATTR Value 2k
SYMBOL Res 5280 1952 R90
WINDOW 0 0 56 VBottom 2
WINDOW 3 32 56 VTop 2
SYMATTR InstName R127
SYMATTR Value 2k
SYMBOL Res 5280 2064 R90
WINDOW 0 0 56 VBottom 2
WINDOW 3 32 56 VTop 2
SYMATTR InstName R128
SYMATTR Value 2k
SYMBOL Res 5360 2304 R180
WINDOW 0 36 76 Left 2
WINDOW 3 36 40 Left 2
SYMATTR InstName R129
SYMATTR Value 1k
SYMBOL Res 5360 2416 R180
WINDOW 0 36 76 Left 2
WINDOW 3 36 40 Left 2
SYMATTR InstName R130
SYMATTR Value 1k
SYMBOL Res 5360 2528 R180
WINDOW 0 36 76 Left 2
WINDOW 3 36 40 Left 2
SYMATTR InstName R131
SYMATTR Value 1k
SYMBOL Res 5360 2640 R180
WINDOW 0 36 76 Left 2
WINDOW 3 36 40 Left 2
SYMATTR InstName R132
SYMATTR Value 2k
SYMBOL Res 5280 2176 R90
WINDOW 0 0 56 VBottom 2
WINDOW 3 32 56 VTop 2
SYMATTR InstName R133
SYMATTR Value 2k
SYMBOL Res 5280 2288 R90
WINDOW 0 0 56 VBottom 2
WINDOW 3 32 56 VTop 2
SYMATTR InstName R134
SYMATTR Value 2k
SYMBOL Res 5280 2400 R90
WINDOW 0 0 56 VBottom 2
WINDOW 3 32 56 VTop 2
SYMATTR InstName R135
SYMATTR Value 2k
SYMBOL Res 5280 2512 R90
WINDOW 0 0 56 VBottom 2
WINDOW 3 32 56 VTop 2
SYMATTR InstName R136
SYMATTR Value 2k
SYMBOL npn 4368 2560 R0
SYMATTR InstName Q72
SYMATTR Value 2N2222
SYMBOL Res 4416 2416 R0
SYMATTR InstName R51
SYMATTR Value 50
SYMBOL voltage 4304 2608 M0
SYMATTR InstName V10
SYMATTR Value PWL( 0 3 3 3 3.005 0 4 0 4.005 3 6 3 6.005 0 7 0 7.005 3 16 3 16.005 0 19 0 19.005 3 20 3 20.005 0 22 0 22.005 3 23 3 23.005 0 32 0 )
TEXT 584 2064 Left 7 ;D2
TEXT 552 912 Left 7 ;D1
TEXT 1800 2064 Left 7 ;D4
TEXT 1768 912 Left 7 ;D3
TEXT 3000 2064 Left 7 ;D6
TEXT 2968 912 Left 7 ;D5
TEXT 4200 2064 Left 7 ;D8
TEXT 4168 912 Left 7 ;D7
TEXT -256 1608 Left 2 !.tran 32
TEXT 344 2968 Left 7 ;LSB
TEXT 4240 3008 Left 7 ;MSB
TEXT 1960 2984 Left 7 ;Inputs of FlipFlops
TEXT 5072 1360 Left 7 ;Output DAC
TEXT 5096 2800 Left 7 ;Input DAC

The netlist it stands for:
* 1 Byte Memory.asc
V11 +DAC 0 12
V12 0 -DAC 12
V1 CLK 0 PWL( 0 3 17 3 17.005 0 27 0 27.005 3 28 3 28.005 0 32 0 )
V2 +not 0 3
V13 +Vcc 0 5
Q2 Q2 P001 N041 0 2N2222
Q3 N041 N049 0 0 2N2222
R2 +Vcc Q2 100
Q4 N049 CLK N058 0 2N2222
Q5 N058 N067 0 0 2N2222
R3 +Vcc N049 100
R4 N067 D2 1k
R5 P001 _Q2 5k
Q6 _Q2 P002 N042 0 2N2222
Q7 N042 N050 0 0 2N2222
R6 +Vcc _Q2 100
Q8 N050 CLK N059 0 2N2222
Q9 N059 N068 0 0 2N2222
R7 +Vcc N050 100
R8 _D2 N068 1k
R9 Q2 P002 5k
Q10 Q1 P003 N003 0 2N2222
Q11 N003 N011 0 0 2N2222
R10 +Vcc Q1 100
Q12 N011 CLK N022 0 2N2222
Q13 N022 N030 0 0 2N2222
R11 +Vcc N011 100
R12 N030 D1 1k
R13 P003 _Q1 5k
Q14 _Q1 P004 N004 0 2N2222
Q15 N004 N012 0 0 2N2222
R14 +Vcc _Q1 100
Q16 N012 CLK N023 0 2N2222
Q17 N023 N031 0 0 2N2222
R15 +Vcc N012 100
R16 _D1 N031 1k
R17 Q1 P004 5k
Q18 Q4 P005 N043 0 2N2222
Q19 N043 N051 0 0 2N2222
R18 +Vcc Q4 100
Q20 N051 CLK N060 0 2N2222
Q21 N060 N069 0 0 2N2222
R19 +Vcc N051 100
R20 N069 D4 1k
R21 P005 _Q4 5k
Q22 _Q4 P006 N044 0 2N2222
Q23 N044 N052 0 0 2N2222
R22 +Vcc _Q4 100
Q24 N052 CLK N061 0 2N2222
Q25 N061 N070 0 0 2N2222
R23 +Vcc N052 100
R24 _D4 N070 1k
R25 Q4 P006 5k
Q26 Q3 P007 N005 0 2N2222
Q27 N005 N013 0 0 2N2222
R26 +Vcc Q3 100
Q28 N013 CLK N024 0 2N2222
Q29 N024 N032 0 0 2N2222
R27 +Vcc N013 100
R28 N032 D3 1k
R29 P007 _Q3 5k
Q30 _Q3 P008 N006 0 2N2222
Q31 N006 N014 0 0 2N2222
R30 +Vcc _Q3 100
Q32 N014 CLK N025 0 2N2222
Q33 N025 N033 0 0 2N2222
R31 +Vcc N014 100
R32 _D3 N033 1k
R33 Q3 P008 5k
Q34 Q6 P009 N045 0 2N2222
Q35 N045 N053 0 0 2N2222
R34 +Vcc Q6 100
Q36 N053 CLK N062 0 2N2222
Q37 N062 N071 0 0 2N2222
R35 +Vcc N053 100
R36 N071 D6 1k
R37 P009 _Q6 5k
Q38 _Q6 P010 N046 0 2N2222
Q39 N046 N054 0 0 2N2222
R38 +Vcc _Q6 100
Q40 N054 CLK N063 0 2N2222
Q41 N063 N072 0 0 2N2222
R39 +Vcc N054 100
R40 _D6 N072 1k
R41 Q6 P010 5k
Q42 Q5 P011 N007 0 2N2222
Q43 N007 N015 0 0 2N2222
R42 +Vcc Q5 100
Q44 N015 CLK N026 0 2N2222
Q45 N026 N034 0 0 2N2222
R43 +Vcc N015 100
R44 N034 D5 1k
R45 P011 _Q5 5k
Q46 _Q5 P012 N008 0 2N2222
Q47 N008 N016 0 0 2N2222
R46 +Vcc _Q5 100
Q48 N016 CLK N027 0 2N2222
Q49 N027 N035 0 0 2N2222
R47 +Vcc N016 100
R48 _D5 N035 1k
R49 Q5 P012 5k
Q50 Q8 P013 N047 0 2N2222
Q51 N047 N055 0 0 2N2222
R66 +Vcc Q8 100
Q52 N055 CLK N064 0 2N2222
Q53 N064 N073 0 0 2N2222
R67 +Vcc N055 100
R68 N073 D8 1k
R69 P013 _Q8 5k
Q54 _Q8 P014 N048 0 2N2222
Q55 N048 N056 0 0 2N2222
R70 +Vcc _Q8 100
Q56 N056 CLK N065 0 2N2222
Q57 N065 N074 0 0 2N2222
R71 +Vcc N056 100
R72 _D8 N074 1k
R73 Q8 P014 5k
Q58 Q7 P015 N009 0 2N2222
Q59 N009 N017 0 0 2N2222
R74 +Vcc Q7 100
Q60 N017 CLK N028 0 2N2222
Q61 N028 N036 0 0 2N2222
R75 +Vcc N017 100
R76 N036 D7 1k
R77 P015 _Q7 5k
Q62 _Q7 P016 N010 0 2N2222
Q63 N010 N018 0 0 2N2222
R78 +Vcc _Q7 100
Q64 N018 CLK N029 0 2N2222
Q65 N029 N037 0 0 2N2222
R79 +Vcc N018 100
R80 _D7 N037 1k
R81 Q7 P016 5k
Q1 _D1 D1 0 0 2N2222
R1 +not _D1 50
V3 D1 0 PWL( 0 3 3 3 3.005 0 4 0 4.005 3 16 3 16.005 0 32 0 )
Q66 _D2 D2 0 0 2N2222
R82 +not _D2 50
V4 D2 0 PWL( 0 3 16 3 16.005 0 32 0 )
Q68 _D3 D3 0 0 2N2222
R84 +not _D3 50
V6 D3 0 PWL( 0 3 16 3 16.005 0 32 0 )
Q69 _D4 D4 0 0 2N2222
R85 +not _D4 50
V7 D4 0 PWL( 0 3 9 3 9.005 0 10 0 10.005 3 16 3 16.005 0 32 0 )
Q70 _D5 D5 0 0 2N2222
R86 +not _D5 50
V8 D5 0 PWL( 0 3 3 3 3.005 0 4 0 4.005 3 16 3 16.005 0 27.2 0 27.2005 3 28.2 3 28.2005 0 32 0 )
Q71 _D6 D6 0 0 2N2222
R87 +not _D6 50
V9 D6 0 PWL( 0 3 6 3 6.005 0 7 0 7.005 3 16 3 16.005 0 32 0 )
Q73 _D7 D7 0 0 2N2222
R89 +not _D7 50
V14 D7 0 PWL( 0 0 12 0 12.005 3 13 3 13.005 0 16 0 16.005 0 19 0 19.005 3 20 3 20.005 0 32 0 )
XU3 N001 OUT +DAC -DAC OUT LT1001  ; OP07, pins In+ In- V+ V- OUT
R105 N002 N001 1k
R106 N019 N002 1k
R107 N020 N019 1k
R108 N021 N020 1k
R109 N001 Q8 2k
R110 N002 Q7 2k
R111 N019 Q6 2k
R112 N020 Q5 2k
R113 N038 N021 1k
R114 N039 N038 1k
R115 N040 N039 1k
R116 0 N040 2k
R117 N021 Q4 2k
R118 N038 Q3 2k
R119 N039 Q2 2k
R120 N040 Q1 2k
XU4 DACin IN +DAC -DAC IN LT1001  ; OP07, pins In+ In- V+ V- OUT
R121 N057 DACin 1k
R122 N066 N057 1k
R123 N075 N066 1k
R124 N076 N075 1k
R125 DACin D8 2k
R126 N057 D7 2k
R127 N066 D6 2k
R128 N075 D5 2k
R129 N077 N076 1k
R130 N078 N077 1k
R131 N079 N078 1k
R132 0 N079 2k
R133 N076 D4 2k
R134 N077 D3 2k
R135 N078 D2 2k
R136 N079 D1 2k
Q72 _D8 D8 0 0 2N2222
R51 +not _D8 50
V10 D8 0 PWL( 0 3 3 3 3.005 0 4 0 4.005 3 6 3 6.005 0 7 0 7.005 3 16 3 16.005 0 19 0 19.005 3 20 3 20.005 0 22 0 22.005 3 23 3 23.005 0 32 0 )
.model NPN NPN
.model PNP PNP
.lib standard.bjt
* D2
* D1
* D4
* D3
* D6
* D5
* D8
* D7
.tran 32
* LSB
* MSB
* Inputs of FlipFlops
* Output DAC
* Input DAC
.lib LTC.lib
.backanno
.end